# EAGLE design cerebellar V1.2 (EAGLE 9.6.2)
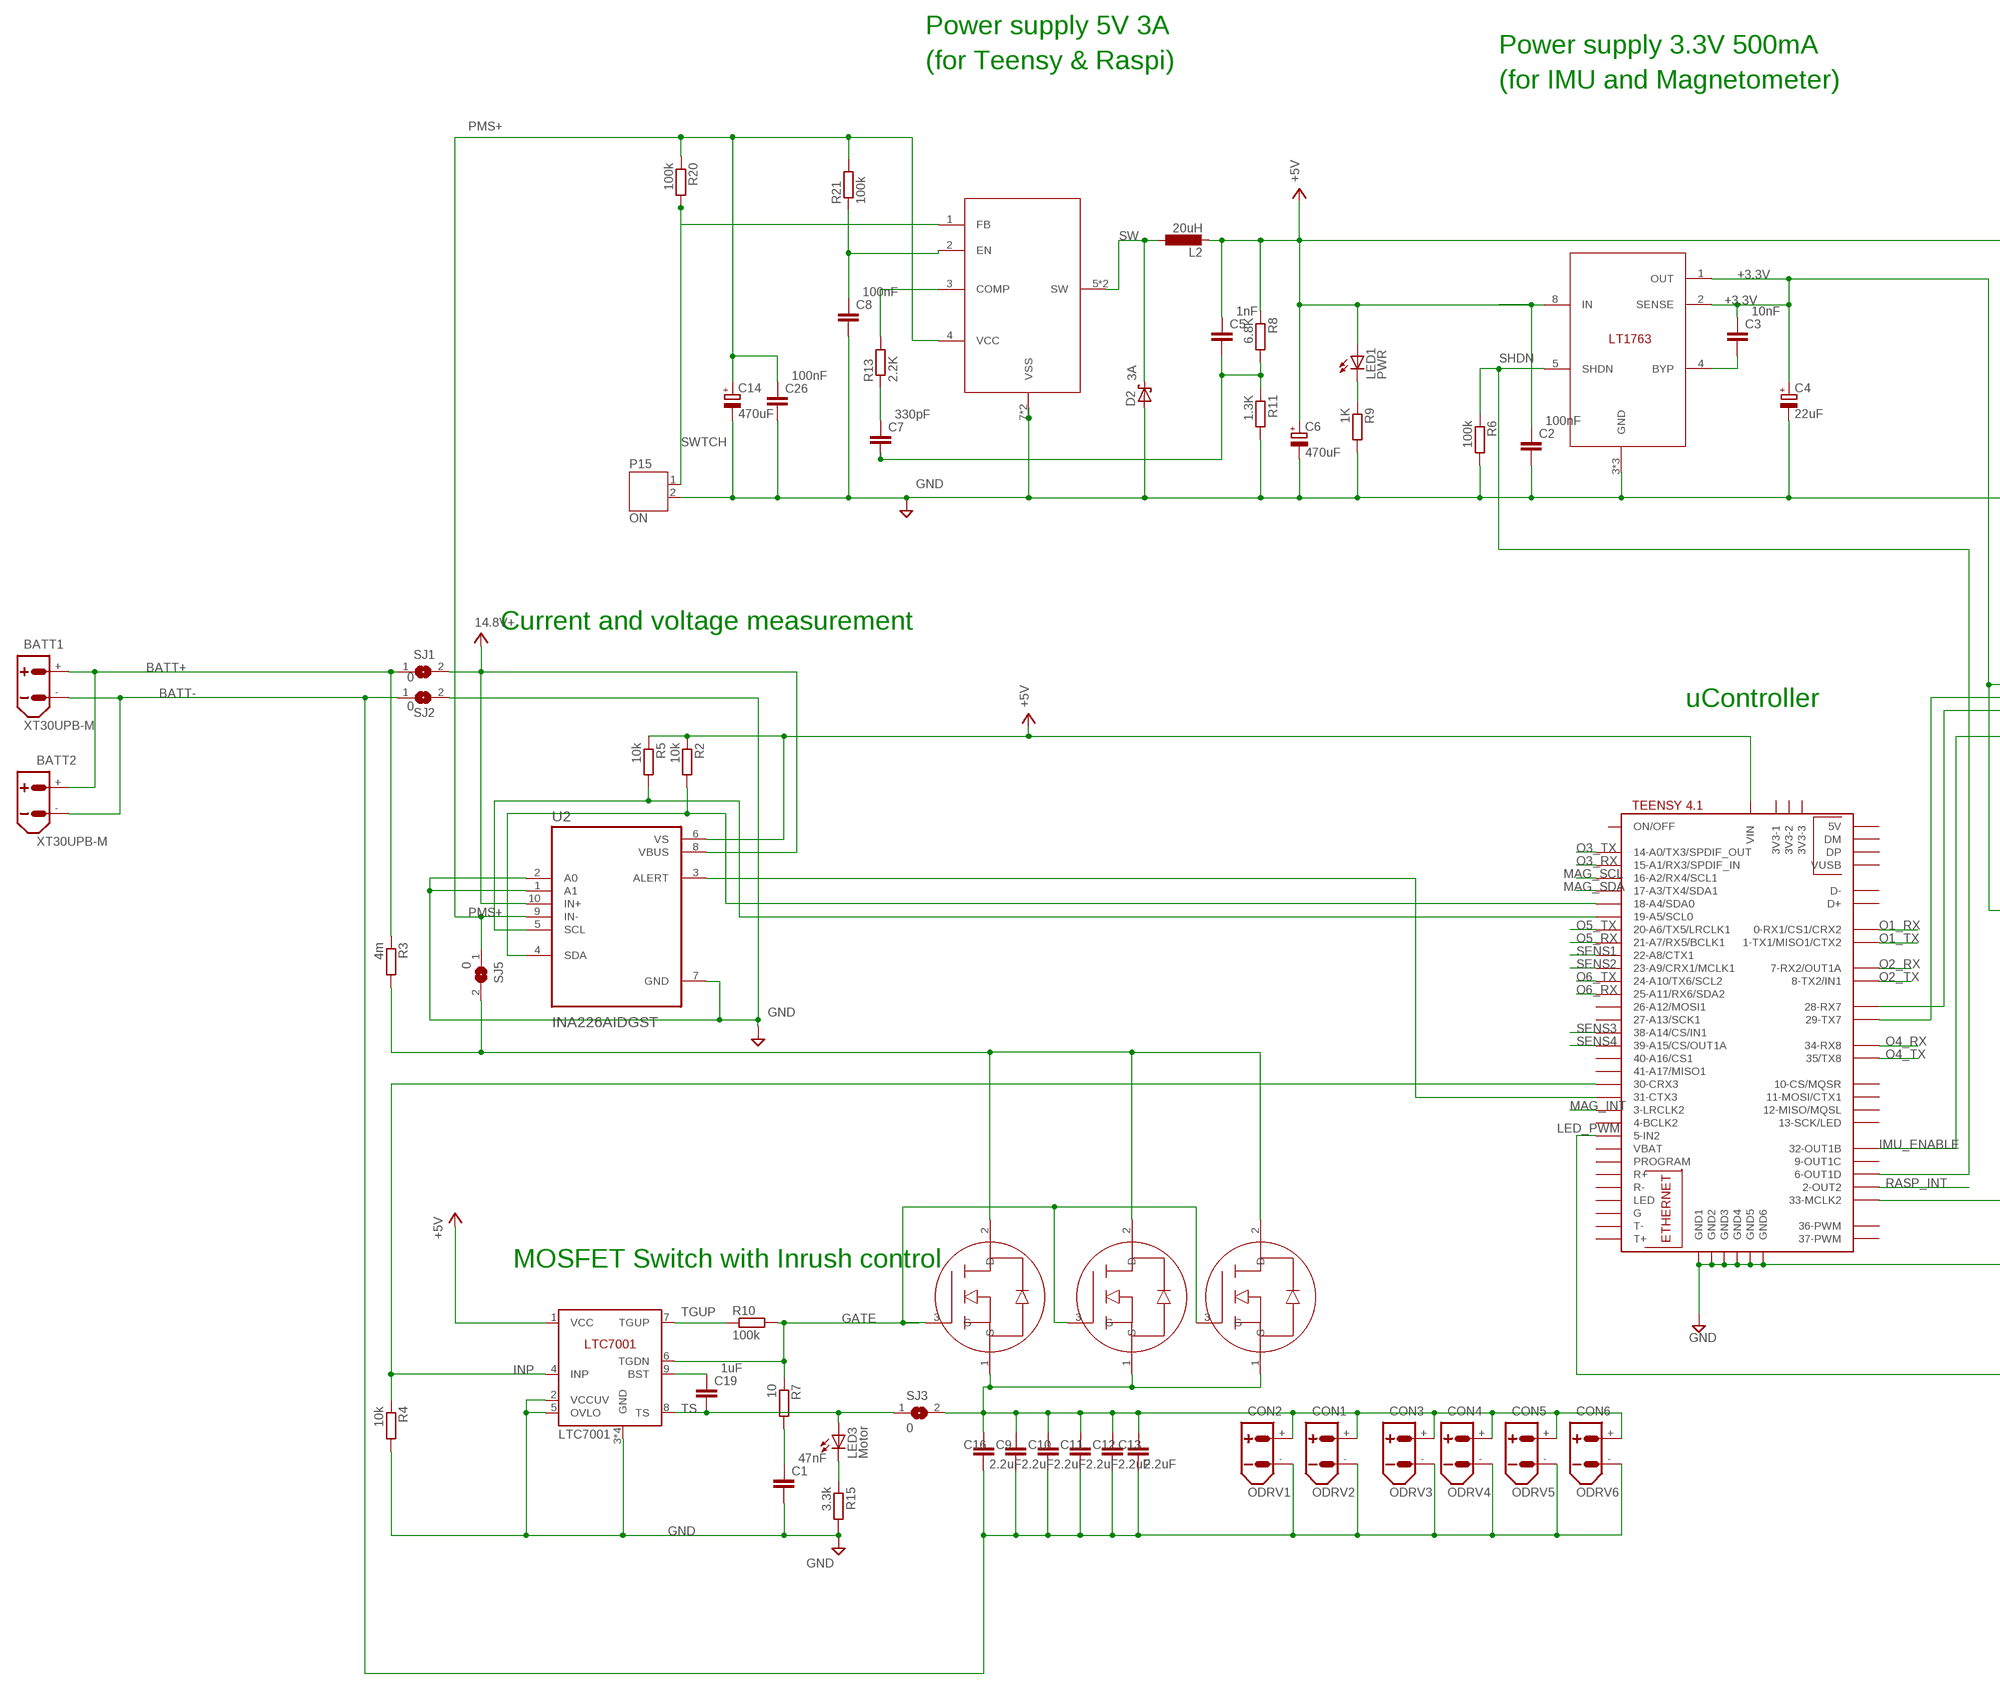
[diagram p0: schematic, sheet 1, part 1 of 2]
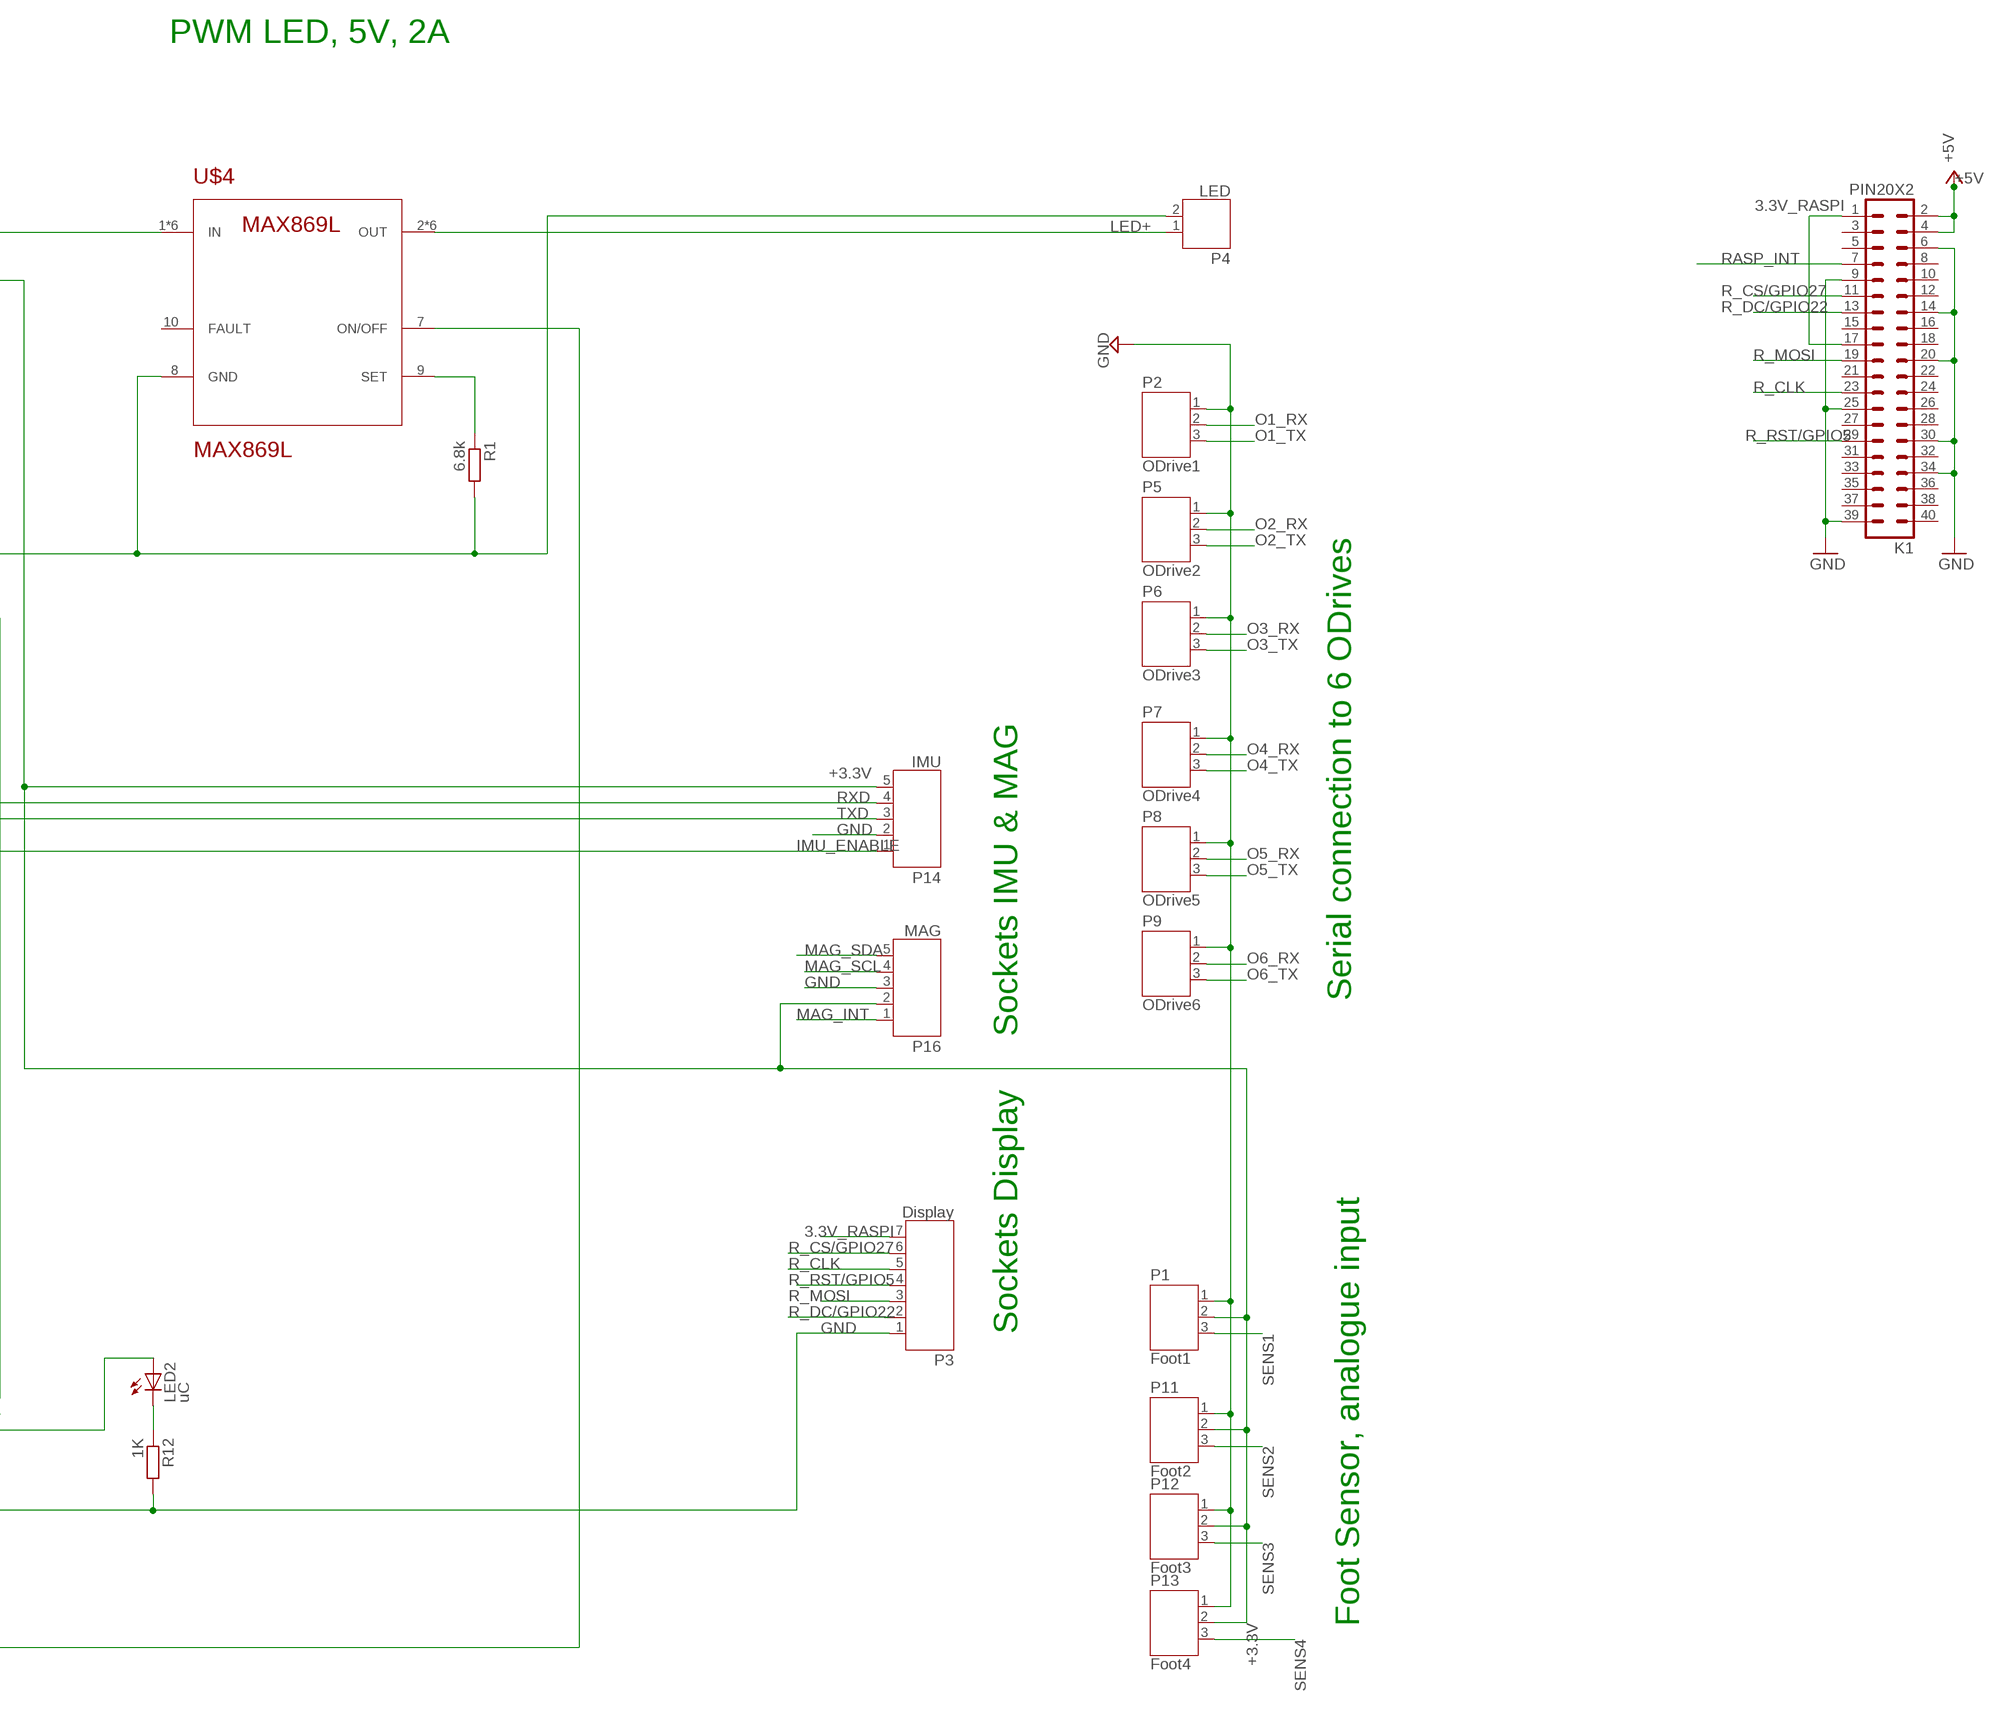
[diagram p1: schematic, sheet 1, part 2 of 2]

## Parts
BATT1  XT30UPB-M  [XT30UPB-M]
BATT2  XT30UPB-M  [XT30UPB-M]
C1  47nF  C-EU050-024X044  [C050-024X044]
C2  100nF  C-EU050-024X044  [C050-024X044]
C3  10nF  C-EU050-024X044  [C050-024X044]
C4  22uF  CPOL-EUE2-4  [E2-4]
C5  1nF  C-EU050-024X044  [C050-024X044]
C6  470uF  CPOL-EUE2.5-6  [E2,5-6]
C7  330pF  C-EU050-024X044  [C050-024X044]
C8  100nF  C-EU050-024X044  [C050-024X044]
C9  2.2uF  C-EU050-024X044  [C050-024X044]
C10  2.2uF  C-EU050-024X044  [C050-024X044]
C11  2.2uF  C-EU050-024X044  [C050-024X044]
C12  2.2uF  C-EU050-024X044  [C050-024X044]
C13  2.2uF  C-EU050-024X044  [C050-024X044]
C14  470uF  CPOL-EUE2.5-6  [E2,5-6]
C16  2.2uF  C-EU050-024X044  [C050-024X044]
C19  1uF  C-EU050-024X044  [C050-024X044]
C26  100nF  C-EU050-024X044  [C050-024X044]
CON1  ODRV2  XT30UPB-F  [XT30UPB-F]
CON2  ODRV1  XT30UPB-F  [XT30UPB-F]
CON3  ODRV3  XT30UPB-F  [XT30UPB-F]
CON4  ODRV4  XT30UPB-F  [XT30UPB-F]
CON5  ODRV5  XT30UPB-F  [XT30UPB-F]
CON6  ODRV6  XT30UPB-F  [XT30UPB-F]
D2  3A  SCHOTTKY-DIODEDO41  [DO41-10]
IC3  LTC7001  [MSOP10]
K1  PIN20X2  [PIN_20X2]
L2  20uH  L-EUIRF-3  [IRF-3]
LED1  PWR  LED3MM  [LED3MM]
LED2  uC  LED3MM  [LED3MM]
LED3  Motor  LED3MM  [LED3MM]
P1  Foot1  JST-PH3  [JST-PH3]
P2  ODrive1  JST-PH3  [JST-PH3]
P3  Display  JST-PH7  [JST-PH7]
P4  LED  JST-PH2  [JST-PH2]
P5  ODrive2  JST-PH3  [JST-PH3]
P6  ODrive3  JST-PH3  [JST-PH3]
P7  ODrive4  JST-PH3  [JST-PH3]
P8  ODrive5  JST-PH3  [JST-PH3]
P9  ODrive6  JST-PH3  [JST-PH3]
P11  Foot2  JST-PH3  [JST-PH3]
P12  Foot3  JST-PH3  [JST-PH3]
P13  Foot4  JST-PH3  [JST-PH3]
P14  IMU  JST-PH5  [JST-PH5]
P15  ON  JST-PH2  [JST-PH2]
P16  MAG  JST-PH5  [JST-PH5]
R1  6.8k  R-EU_0204/7  [0204/7]
R2  10k  R-EU_0204/7  [0204/7]
R3  4m  R-EU_R2512  [R2512]
R4  10k  R-EU_0204/7  [0204/7]
R5  10k  R-EU_0204/7  [0204/7]
R6  100k  R-EU_0204/7  [0204/7]
R7  10  R-EU_0204/7  [0204/7]
R8  6.8K  R-EU_0204/7  [0204/7]
R9  1K  R-EU_0204/7  [0204/7]
R10  100k  R-EU_0204/7  [0204/7]
R11  1.3K  R-EU_0204/7  [0204/7]
R12  1K  R-EU_0204/7  [0204/7]
R13  2.2K  R-EU_0204/7  [0204/7]
R15  3.3k  R-EU_0204/7  [0204/7]
R20  100k  R-EU_0204/7  [0204/7]
R21  100k  R-EU_0204/7  [0204/7]
SJ1  0  SJ  [SJ]
SJ2  0  SJ  [SJ]
SJ3  0  SJ  [SJ]
SJ5  0  SJ  [SJ]
U2  INA226AIDGST  [SOP50P490X110-10N]
U$1  TEENSY41  [TEENSY41]
U$2  IRF2804-BACK  [TO-220H-BACK]
U$3  IRF2804-BACK  [TO-220H-BACK]
U$4  MAX869L  MAX769L  [TSSOP-16]
U$5  IRF2804-BACK  [TO-220H-BACK]
U$6  TS2509  [SO08]
U$8  LT1763  [SO08]

## Nets
3.3V_RASPI: K1.1 K1.17 P3.7
+3.3V: C3.1 C4.+ P1.2 P11.2 P12.2 P13.2 P14.5 P16.2 U$8.1(OUT) U$8.2(SENSE)
+5V [5V]: C2.1 C5.1 C6.+ IC3.1(VCC) K1.2 K1.4 L2.2 LED1.A R2.1 R5.1 R8.1 U2.6(VS) U$1.VIN U$4.1(IN) U$4.4(IN) U$4.5(IN) U$4.12(IN) U$4.13(IN) U$4.16(IN) U$8.8(IN)
BATT+ [Battery]: BATT1.+ BATT2.+ R3.1 SJ1.1
BATT- [Battery]: BATT1.- BATT2.- C9.2 C10.2 C11.2 C12.2 C13.2 C16.2 CON1.- CON2.- CON3.- CON4.- CON5.- CON6.- SJ2.1
DRAIN [Battery]: R3.2 SJ5.2 U$2.2(D) U$3.2(D) U$5.2(D)
GATE: IC3.6(TGDN) R7.1 R10.2 U$2.3(G) U$3.3(G) U$5.3(G)
GND: C1.2 C2.2 C4.- C6.- C8.2 C14.- C26.2 D2.A IC3.2(VCCUV) IC3.3(GND) IC3.5(OVLO) IC3.10(GND) IC3.11(GND) IC3.12(GND) K1.6 K1.9 K1.14 K1.20 K1.25 K1.30 K1.34 K1.39 P1.1 P2.1 P3.1 P4.2 P5.1 P6.1 P7.1 P8.1 P9.1 P11.1 P12.1 P13.1 P14.2 P15.2 P16.3 R1.2 R4.2 R6.2 R9.2 R11.2 R12.2 R15.2 SJ2.2 U2.1(A1) U2.2(A0) U2.7(GND) U$1.GND1 U$1.GND2 U$1.GND3 U$1.GND4 U$1.GND5 U$1.GND6 U$4.8(GND) U$6.7(VSS) U$6.8(VSS) U$8.3(GND) U$8.6(GND) U$8.7(GND)
IMU_ENABLE: P14.1 U$1.32-OUT1B
INP: IC3.4(INP) R4.1 U$1.30-CRX3
LED+: P4.1 U$4.2(OUT) U$4.3(OUT) U$4.6(OUT) U$4.11(OUT) U$4.14(OUT) U$4.15(OUT)
LED_PWM: U$1.5-IN2 U$4.7(ON/OFF)
MAG_INT: P16.1 U$1.3-LRCLK2
MAG_SCL: P16.4 U$1.16-A2/RX4/SCL1
MAG_SDA: P16.5 U$1.17-A3/TX4/SDA1
N$1: C1.1 R7.2
N$2: R1.1 U$4.9(SET)
N$3: LED2.K(C) R12.1
N$4: LED2.A U$1.33-MCLK2
N$5: U2.3(ALERT) U$1.31-CTX3
N$7: C5.2 C7.2 R8.2 R11.1
N$8: C3.2 U$8.4(BYP)
N$9: R13.2 U$6.3(COMP)
N$10: C7.1 R13.1
N$17: R5.2 U2.5(SCL) U$1.19-A5/SCL0
N$22: R2.2 U2.4(SDA) U$1.18-A4/SDA0
N$24: C19.1 IC3.9(BST)
N$30: LED3.K(C) R15.1
N$39: LED1.K(C) R9.1
N$46: C8.1 R21.1 U$6.2(EN)
O1_RX: P2.2 U$1.0-RX1/CS1/CRX2
O1_TX: P2.3 U$1.1-TX1/MISO1/CTX2
O2_RX: P5.2 U$1.7-RX2/OUT1A
O2_TX: P5.3 U$1.8-TX2/IN1
O3_RX: P6.2 U$1.15-A1/RX3/SPDIF_IN
O3_TX: P6.3 U$1.14-A0/TX3/SPDIF_OUT
O4_RX: P7.2 U$1.34-RX8
O4_TX: P7.3 U$1.35-TX8(35/TX8)
O5_RX: P8.2 U$1.21-A7/RX5/BCLK1
O5_TX: P8.3 U$1.20-A6/TX5/LRCLK1
O6_RX: P9.2 U$1.25-A11/RX6/SDA2
O6_TX: P9.3 U$1.24-A10/TX6/SCL2
PMS+: C14.+ C26.1 R20.1 R21.2 SJ5.1 U2.9(IN-) U$6.4(VCC)
POWER+ [Battery]: C9.1 C10.1 C11.1 C12.1 C13.1 C16.1 CON1.+ CON2.+ CON3.+ CON4.+ CON5.+ CON6.+ SJ3.2 U$2.1(S) U$3.1(S) U$5.1(S)
R_CLK: K1.23 P3.5
R_CS/GPIO27: K1.11 P3.6
R_DC/GPIO22: K1.13 P3.2
R_MOSI: K1.19 P3.3
R_RST/GPIO5: K1.29 P3.4
RASP_INT: K1.7 U$1.2-OUT2
RXD: P14.4 U$1.29-TX7
SENS1: P1.3 U$1.22-A8/CTX1
SENS2: P11.3 U$1.23-A9/CRX1/MCLK1
SENS3: P12.3 U$1.38-A14/CS/IN1
SENS4: P13.3 U$1.39-A15/CS/OUT1A
SHDN: R6.1 U$1.6-OUT1D U$8.5(SHDN)
SW [5V]: D2.C L2.1 U$6.5(SW) U$6.6(SW)
SWTCH: P15.1 R20.2 U$6.1(FB)
TGUP: IC3.7(TGUP) R10.1
TS: C19.2 IC3.8(TS) LED3.A SJ3.1
TXD: P14.3 U$1.28-RX7
V+: SJ1.2 U2.8(VBUS) U2.10(IN+) ; supply symbol labelled 14.8V+
Unconnected: K1.3 K1.5 K1.8 K1.10 K1.12 K1.15 K1.16 K1.18 K1.21 K1.22 K1.24 K1.26 K1.27 K1.28 K1.31 K1.32 K1.33 K1.35 K1.36 K1.37 K1.38 K1.40 U$1.3V3-1 U$1.3V3-2 U$1.3V3-3 U$1.4-BCLK2 U$1.9-OUT1C U$1.10-CS\MQSR(10-CS/MQSR) U$1.11-MOSI/CTX1 U$1.12-MISO/MQSL U$1.13-SCK/LED U$1.26-A12/MOSI1 U$1.27-A13/SCK1 U$1.36-PWM U$1.37-PWM U$1.40-A16/CS1 U$1.41-A17/MISO1 U$1.+5V(5V) U$1.D+ U$1.D- U$1.DM U$1.DP U$1.G U$1.LED U$1.ON/OFF U$1.PROGRAM U$1.R+ U$1.R- U$1.T+ U$1.T- U$1.VBAT U$1.VUSB U$4.10(FAULT)

## Notes on the sheet
- Power supply 5V 3A
  (for Teensy & Raspi)
- Power supply 3.3V 500mA
  (for IMU and Magnetometer)
- PWM LED, 5V, 2A
- Serial connection to 6 ODrives
- Current and voltage measurement
- uController
- Sockets IMU & MAG
- Foot Sensor, analogue input
- Sockets Display
- MOSFET Switch with Inrush control

## Library data of the parts
BATT1 BATT2 CON1-CON6 = amass:XT30: AMASS XT30 connector Store in Japan AMASS XT30 connector <https://szc.jp/ams-xt30>
C1-C3 C5 C7-C13 C16 C19 C26 = rcl:C-EU: CAPACITOR, European symbol; SPICEPREFIX: C
C4 C6 C14 = rcl:CPOL-EU: POLARIZED CAPACITOR, European symbol; SPICEPREFIX: C
D2 = adafruit:SCHOTTKY-DIODE: Schottky Diode
IC3 = LTC7001:LTC7001: Fast 150V High Side NMOS Static Switch Driver Source: https://www.analog.com/en/products/ltc7001.html; MPN: AD7992BRMZ-0; OC_FARNELL: 1078311; OC_NEWARK: 31M4422
K1 = FLYFISH:PIN20X2
L2 = rcl:L-EU: INDUCTOR, European symbol; SPICEPREFIX: L
LED1-LED3 = adafruit:LED: LED OSRAM: - CHIPLED LG R971, LG N971, LY N971, LG Q971, LY Q971, LO R971, LY R971 LH N974, LH R974 LS Q976, LO Q976, LY Q976 LO Q996 - Hyper CHIPLED LW Q18S LB Q993, LB Q99A, LB R99A - SideLED LS A670, LO A670, LY A670, LG A670, LP A670 LB A673, LV A673, LT A673, LW A673 LH A674 LY A675 LS A676, LA A676, LO A676, LY A676, LW A676 LS A679, LY A679, LG A679 - Hyper Micro SIDELED® LS Y876, LA Y876, LO Y876, LY Y876 LT Y87S - SmartLED LW L88C, LW L88S LB L89C, LB L89S, LG L890 LS L89K, LO L89K, LY L89K LS L896, LA L896, LO L896, LY L896 - TOPLED LS T670, LO T670, LY T670, LG T670, LP T670 LSG T670, LSP T670, LSY T670, LOP T670, LYG T670 LG T671, LOG T671, LSG T671 LB T673, LV T673, LT T673, LW T673 LH T674 LS T676, LA T676, LO T676, LY T676, LB T676, LH T676, LSB T676, LW T676 LB T67C, LV T67C, LT T67C, LS T67K, LO T67K, LY T67K, LW E67C LS E67B, LA E67B, LO E67B, LY E67B, LB E67C, LV E67C, LT E67C LW T67C LS T679, LY T679, LG T679 LS T770, LO T770, LY T770, LG T770, LP T770 LB T773, LV T773, LT T773, LW T773 LH T774 LS E675, LA E675, LY E675, LS T675 LS T776, LA T776, LO T776, LY T776, LB T776 LHGB T686 LT T68C, LB T68C - Hyper Mini TOPLED® LB M676 - Mini TOPLED Santana® LG M470 LS M47K, LO M47K, LY M47K Source: http://www.osram.convergy.de/
P1 P2 P5-P9 P11-P13 = jst-ph:JST-PH3
P3 = jst-ph:JST-PH7
P4 P15 = jst-ph:JST-PH2
P14 P16 = jst-ph:JST-PH5
R1 R2 R4-R13 R15 R20 R21 = rcl:R-EU_: RESISTOR, European symbol; SPICEPREFIX: R
R3 = rcl:R-EU_: RESISTOR, European symbol; DIGIKEY: 541-WSK25124L000FEACT-ND; LINK: https://octopart.com/wsk25124l000fea-vishay-41934978?r=sp; MOUSER: 71-WSK25124L000FEA; SPICEPREFIX: R
SJ1-SJ3 SJ5 = jumper:SJ: SMD solder JUMPER
U2 = INA226AIDGST:INA226AIDGST: Check availability <https://pricing.snapeda.com/parts/INA226AIDGST/Texas%20Instruments/view-part?ref=eda>; AVAILABILITY: In Stock; DESCRIPTION: 36V, 16-bit, ultra-precise i2c output current/voltage/power monitor w/alert; MF: Texas Instruments; MP: INA226AIDGST; PACKAGE: VSSOP-10 Texas Instruments; PRICE: None; PURCHASE-URL: https://pricing.snapeda.com/search/part/INA226AIDGST/?ref=eda
U$1 = teensy:TEENSY41
U$2 U$3 U$5 = IRF2804:IRF2804-BACK: N-Channel Power MOSFET
U$4 = MAX869:MAX769L: MAX869L 2A, Current-Limited, High-Side P-Channel Switch with Thermal Shutdown
U$6 = TS2509:TS2509
U$8 = LT1763:LT1763

## Net classes
0 default: width 0.254 mm, clearance 0.152 mm
1 Battery: width 1.575 mm, clearance 0.152 mm
2 5V: width 0.406 mm, clearance 0.152 mm

## Board
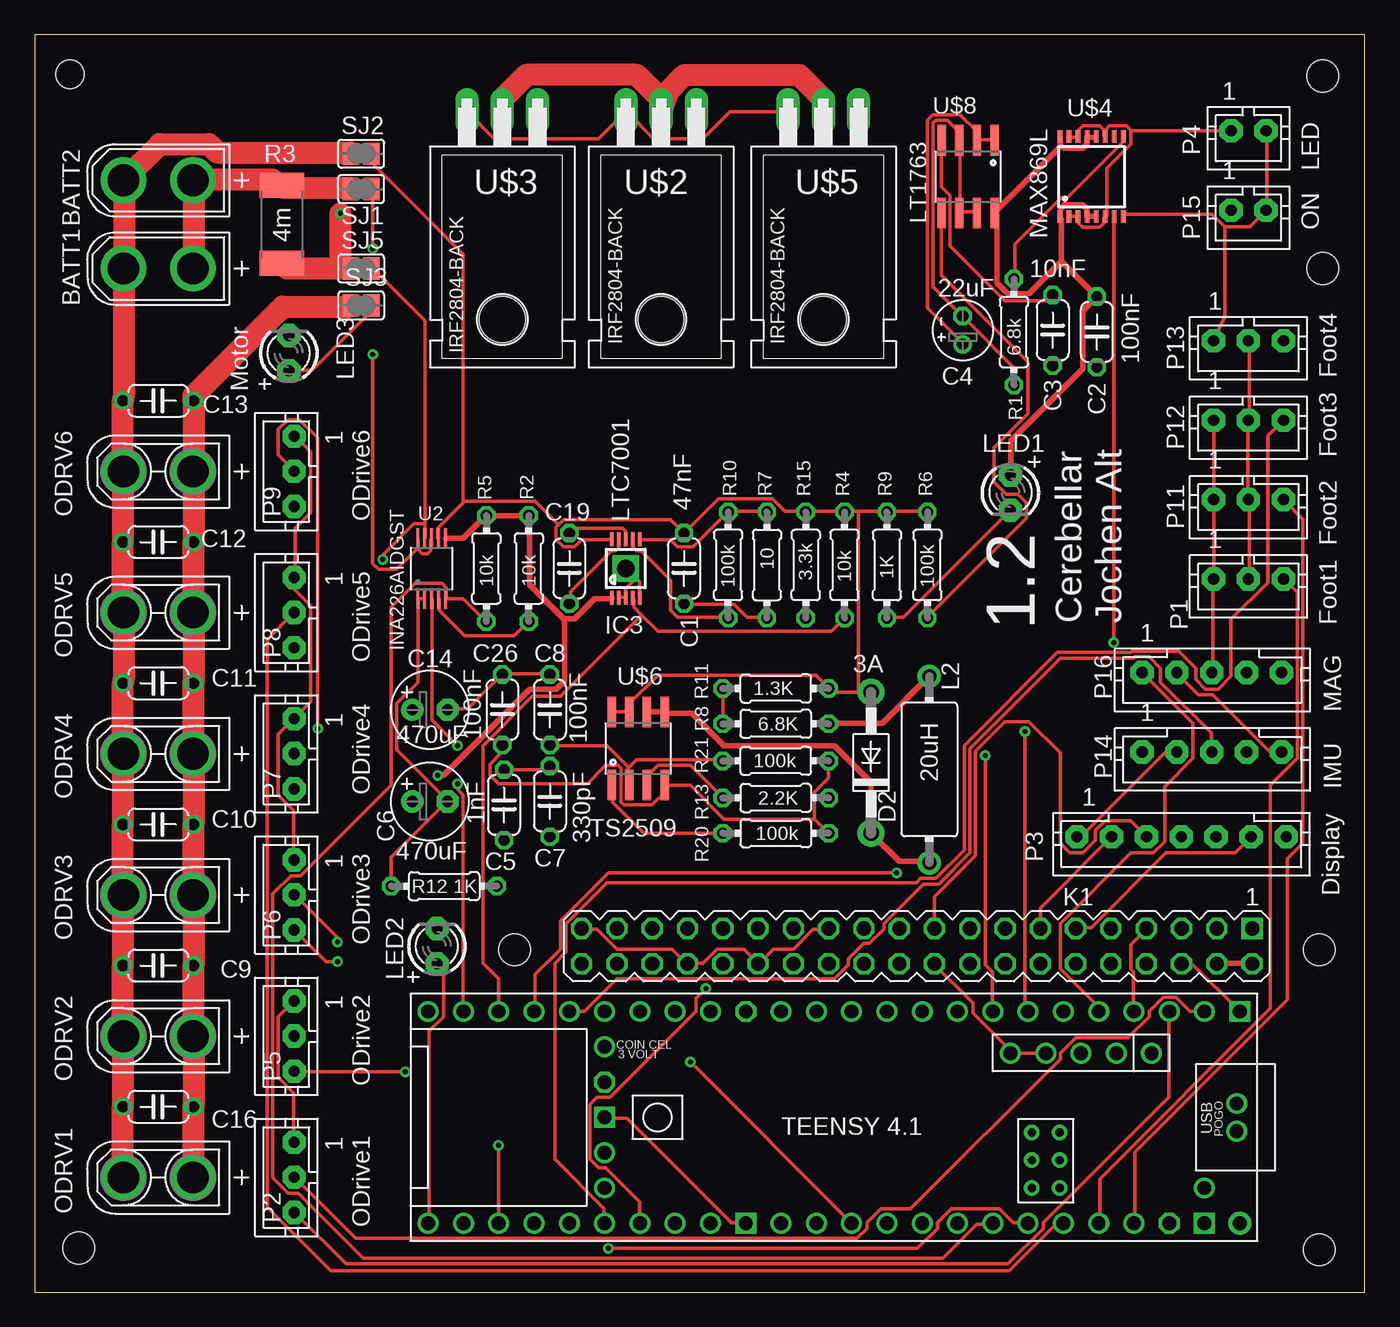
[diagram p2: board, top side]
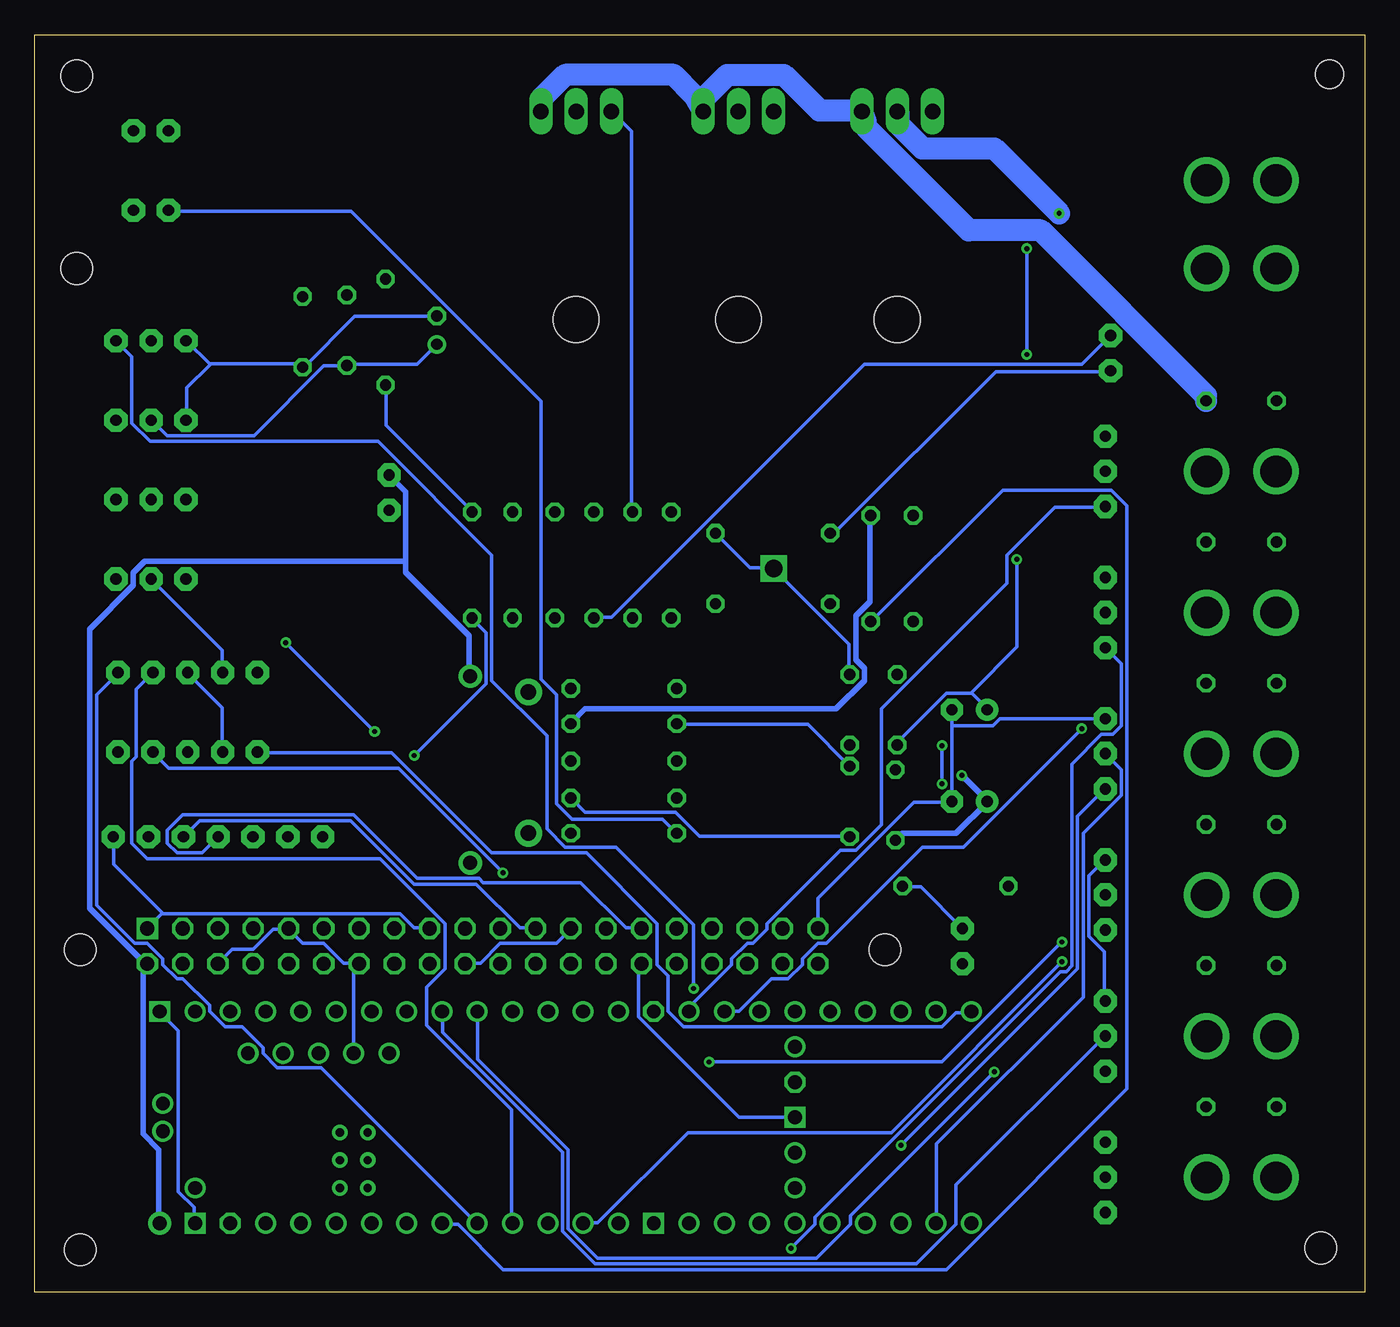
[diagram p3: board, bottom side, seen from below]

Size 95.74 x 90.47 mm. Coordinates in mm from the lower left corner, seen from the top.
Outline: 0,0 95.74,0 95.74,90.47 0,90.47 0,0
Copper layers (1*16): Top 0.035mm / dielectric 1.5mm / Bottom 0.035mm
Design rules "default": minimum track width 6mil, minimum drill 0.35mm, track to track 6mil, track to pad 6mil, pad to pad 6mil, via to via 6mil, smd to smd 6mil, copper to edge 40mil, drill to drill 6mil, minimum pad ring 10mil, minimum via ring 8mil, stop-mask expansion 4mil, vias tented up to drill 0mil, thermal gap 10mil
Holes 2.03 mm at 2.54,87.63
Holes 2.29 mm at 3.17,3.17 92.71,87.5 92.46,3.05 92.46,24.64 34.54,24.64 92.71,73.66
bRestrict: area 33.8,23.9 to 35.3,25.4; area 91.8,23.9 to 93.3,25.4; area 92,72.9 to 93.6,74.4; area 92,2.3 to 93.6,3.8; area 1.9,86.9 to 3.4,88.4; area 2.4,2.3 to 3.9,3.8; area 91.8,86.6 to 93.3,88.1

### Footprints (pad centres in the part's own frame; a part is rotated, then mirrored left to right if it is on the bottom)
XT30UPB-M = drill 2.286: + 2.5,0; - -2.5,0
C050-024X044 = drill 0.813 octagon: 1 -2.54,0; 2 2.54,0
E2-4 = drill 0.813 pad 1.27: + -1.016,0 | drill 0.813 pad 1.27 octagon: - 1.016,0
E2,5-6 = drill 0.813 pad 1.6: + -1.27,0 | drill 0.813 pad 1.6 octagon: - 1.27,0
XT30UPB-F = drill 2.286: + 2.5,0; - -2.5,0
DO41-10 = drill 1.118 pad 1.93: A 5.08,0; C -5.08,0
MSOP10 = smd 0.25 x 1: 1 -1,-2.113; 2 -0.5,-2.113; 3 0,-2.113; 4 0.5,-2.113; 5 1,-2.113; 6 1,2.113; 7 0.5,2.113; 8 0,2.113; 9 -0.5,2.113; 10 -1,2.113 | drill 1.27 square: 11 0,0 | smd 1.524 x 1.524: 12 0,0
PIN_20X2 = drill 1.016 square: 1 -24.13,-1.27 | drill 1.016 octagon: 2 -24.13,1.27; 3 -21.59,-1.27; 4 -21.59,1.27; 5 -19.05,-1.27; 6 -19.05,1.27; 7 -16.51,-1.27; 8 -16.51,1.27; 9 -13.97,-1.27; 10 -13.97,1.27; 11 -11.43,-1.27; 12 -11.43,1.27; 13 -8.89,-1.27; 14 -8.89,1.27; 15 -6.35,-1.27; 16 -6.35,1.27; 17 -3.81,-1.27; 18 -3.81,1.27; 19 -1.27,-1.27; 20 -1.27,1.27; 21 1.27,-1.27; 22 1.27,1.27; 23 3.81,-1.27; 24 3.81,1.27; 25 6.35,-1.27; 26 6.35,1.27; 27 8.89,-1.27; 28 8.89,1.27; 29 11.43,-1.27; 30 11.43,1.27; 31 13.97,-1.27; 32 13.97,1.27; 33 16.51,-1.27; 34 16.51,1.27; 35 19.05,-1.27; 36 19.05,1.27; 37 21.59,-1.27; 38 21.59,1.27; 39 24.13,-1.27; 40 24.13,1.27
IRF-3 = drill 1 pad 1.676: 1 -6.705,0; 2 6.73,0
LED3MM = drill 0.813 pad 1.676 octagon: A -1.27,0; K 1.27,0
JST-PH3 = drill 0.813 pad 1.676 octagon: 1 2.524,-1.524; 2 0.016,-1.524; 3 -2.524,-1.524
JST-PH7 = drill 0.813 pad 1.676 octagon: 1 7.54,0; 2 5.032,0; 3 2.524,0; 4 0.016,0; 5 -2.492,0; 6 -5,0; 7 -7.54,0
JST-PH2 = drill 0.813 pad 1.676 octagon: 1 1.254,0; 2 -1.254,0
JST-PH5 = drill 0.813 pad 1.676 octagon: 1 5.762,0; 2 3.254,0; 3 0.746,0; 4 -1.762,0; 5 -4.27,0
0204/7 = drill 0.813 octagon: 1 -3.81,0; 2 3.81,0
R2512 = smd 1.8 x 3.2: 1 -2.8,0; 2 2.8,0
SJ = smd 1.168 x 1.6: 1 -0.762,0; 2 0.762,0
SOP50P490X110-10N = smd 1.47 x 0.28: 1 -2.15,1; 2 -2.15,0.5; 3 -2.15,0; 4 -2.15,-0.5; 5 -2.15,-1; 6 2.15,-1; 7 2.15,-0.5; 8 2.15,0; 9 2.15,0.5; 10 2.15,1
TEENSY41 = drill 1: 0-RX1/CS1/CRX2 -27.94,-7.62; 1-TX1/MISO1/CTX2 -25.4,-7.62; 2-OUT2 -22.86,-7.62; 3-LRCLK2 -20.32,-7.62; 4-BCLK2 -17.78,-7.62; 5-IN2 -15.24,-7.62; 6-OUT1D -12.7,-7.62; 7-RX2/OUT1A -10.16,-7.62; 8-TX2/IN1 -7.62,-7.62; 9-OUT1C -5.08,-7.62; 10-CS\MQSR -2.54,-7.62; 11-MOSI/CTX1 0,-7.62; 12-MISO/MQSL 2.54,-7.62; 13-SCK/LED 2.54,7.62; 14-A0/TX3/SPDIF_OUT 0,7.62; 15-A1/RX3/SPDIF_IN -2.54,7.62; 16-A2/RX4/SCL1 -5.08,7.62; 17-A3/TX4/SDA1 -7.62,7.62; 18-A4/SDA0 -10.16,7.62; 19-A5/SCL0 -12.7,7.62; 20-A6/TX5/LRCLK1 -15.24,7.62; 21-A7/RX5/BCLK1 -17.78,7.62; 22-A8/CTX1 -20.32,7.62; 23-A9/CRX1/MCLK1 -22.86,7.62; 24-A10/TX6/SCL2 7.62,-7.62; 25-A11/RX6/SDA2 10.16,-7.62; 26-A12/MOSI1 12.7,-7.62; 27-A13/SCK1 15.24,-7.62; 28-RX7 17.78,-7.62; 29-TX7 20.32,-7.62; 30-CRX3 22.86,-7.62; 31-CTX3 25.4,-7.62; 32-OUT1B 27.94,-7.62; 33-MCLK2 27.94,7.62; 34-RX8 25.4,7.62; 35-TX8 22.86,7.62; 36-PWM 20.32,7.62; 37-PWM 17.78,7.62; 38-A14/CS/IN1 15.24,7.62; 39-A15/CS/OUT1A 12.7,7.62; 40-A16/CS1 10.16,7.62; 41-A17/MISO1 7.62,7.62; +5V -24.13,-4.62; D+ -30.25,-1; D- -30.25,1; DM -21.59,-4.62; DP -19.05,-4.62; GND4 -16.51,-4.62; GND5 -13.97,-4.62; ON/OFF 15.24,5.08; PROGRAM 15.24,2.54; VBAT 15.24,-5.08; VUSB -27.94,5.08 | drill 1 octagon: 3V3-1 5.08,-7.62; 3V3-2 15.24,-2.54; 3V3-3 -25.4,7.62 | drill 0.6: G -15.51,3.08; LED -17.51,3.08; R+ -17.51,5.08; R- -15.51,5.08; T+ -15.51,1.08; T- -17.51,1.08 | drill 1 square: GND1 -30.48,-7.62; GND2 15.24,0; GND3 5.08,7.62; GND6 -27.94,7.62 | drill 1 pad 1.676: VIN -30.48,7.62
TO-220H-BACK = drill 1.118 long: 1 -2.54,-7.62; 2 0,-7.62; 3 2.54,-7.62 | hole 3.302: 0,7.366
TSSOP-16 = smd 0.9 x 0.35: 1 -2.875,2.275; 2 -2.875,1.625; 3 -2.875,0.975; 4 -2.875,0.325; 5 -2.875,-0.325; 6 -2.875,-0.975; 7 -2.875,-1.625; 8 -2.875,-2.275; 9 2.875,-2.275; 10 2.875,-1.625; 11 2.875,-0.975; 12 2.875,-0.325; 13 2.875,0.325; 14 2.875,0.975; 15 2.875,1.625; 16 2.875,2.275
SO08 = smd 0.61 x 2.21: 1 -1.905,-2.616; 2 -0.635,-2.616; 3 0.635,-2.616; 4 1.905,-2.616; 5 1.905,2.616; 6 0.635,2.616; 7 -0.635,2.616; 8 -1.905,2.616

### Placement (x,y rotation side)
BATT1  8.89,73.66 0 top
BATT2  8.89,80.01 0 top
C1  46.74,52.07 90 top
C2  76.45,69.09 270 top
C3  73.28,69.22 90 top
C4  66.8,69.22 90 top
C5  33.78,35.05 90 top
C6  28.45,35.31 0 top
C7  37.08,35.31 90 top
C8  37.08,41.91 90 top
C9  8.89,23.5 180 top
C10  8.89,33.66 180 top
C11  8.89,43.81 180 top
C12  8.89,53.98 180 top
C13  8.89,64.14 180 top
C14  28.45,41.91 0 top
C16  8.89,13.34 180 top
C19  38.48,52.07 90 top
C26  33.66,41.91 90 top
CON1  8.89,18.41 0 top
CON2  8.89,8.26 0 top
CON3  8.89,28.57 0 top
CON4  8.89,38.73 0 top
CON5  8.89,48.9 0 top
CON6  8.89,59.05 0 top
D2  60.2,38.1 90 top
IC3  42.55,52.07 0 top
K1  63.5,24.89 180 top
L2  64.39,37.59 90 top
LED1  70.23,57.53 270 top
LED2  28.96,24.89 90 top
LED3  18.29,67.56 90 top
P1  87.38,49.78 180 top
P2  17.14,8.26 90 top
P3  82.55,32.77 180 top
P4  87.38,83.57 180 top
P5  17.14,18.41 90 top
P6  17.14,28.57 90 top
P7  17.14,38.73 90 top
P8  17.14,48.9 90 top
P9  17.14,59.05 90 top
P11  87.38,55.5 180 top
P12  87.38,61.21 180 top
P13  87.38,66.93 180 top
P14  85.47,38.86 180 top
P15  87.38,77.85 180 top
P16  85.47,44.58 180 top
R1  70.48,69.09 270 top
R2  35.56,52.07 270 top
R3  17.78,76.83 270 top
R4  58.29,52.32 90 top
R5  32.51,52.07 270 top
R6  64.26,52.32 90 top
R7  52.7,52.32 270 top
R8  53.34,40.89 180 top
R9  61.34,52.32 90 top
R10  49.91,52.32 90 top
R11  53.34,43.43 0 top
R12  29.46,29.21 180 top
R13  53.34,35.56 180 top
R15  55.5,52.32 90 top
R20  53.34,33.02 180 top
R21  53.34,38.23 0 top
SJ1  23.49,79.38 0 top
SJ2  23.49,81.92 0 top
SJ3  23.49,70.99 180 top
SJ5  23.49,73.66 180 top
U2  28.58,52.07 90 top
U$1  56.26,12.57 180 top
U$2  45.09,77.34 180 top
U$3  33.66,77.34 180 top
U$4  76.07,80.26 90 top
U$5  56.77,77.34 180 top
U$6  43.43,39.12 0 top
U$8  67.18,80.26 180 top

### Tracks (layer width: path | path; a pad name or v marks a point on that pad's centre or on a via)
3.3V_RASPI
  Bottom 0.254: 86.61,27.23 69.44,27.23 68.43,26.21 67.31,26.21 K1.17 | 86.61,27.23 87.63,26.21 K1.1 | P3.7 90.07,32.72 90.07,30.79 86.61,27.33 86.61,27.23
+3.3V
  Top 0.254: U$8.1 69.04,82.91 67.82,82.91 U$8.2 67.82,83.52 66.6,84.73 64.67,84.73 64.26,84.33 64.26,70.81 66.8,68.28 C4.+ | P1.2 87.43,51.36 87.43,56.95 P11.2 87.32,57.15 87.32,62.74 P12.2 87.43,62.84 87.43,68.43 P13.2 | P14.5 89.66,38.91 88.85,38.91 84.78,42.98 83.77,42.98 82.24,44.5 P16.2
  Bottom 0.254: C4.+ 66.8,68.17 68.22,66.75 73.2,66.75 C3.1 73.3,66.65 74.93,66.65 79.96,61.62 86.21,61.62 87.32,62.74 P12.2 | P16.2 82.24,44.6 82.24,46.18 87.32,51.26 P1.2
+5V  (via drill 0.35)
  Top 0.406: U2.6 29.62,54.25 30.84,54.25 32.46,55.88 R5.1 R2.1 35.61,55.88 35.61,50.9 38.05,48.46 38.15,48.46 | 38.15,48.46 38.86,48.46 40.28,49.89 41.5,49.89 IC3.1 | v29.01,37.19 29.41,37.19 35.61,43.38 37.54,43.38 38.15,43.99 38.15,48.46 | K1.4 85.09,23.67 87.63,23.67 K1.2 | R8.1 57.15,40.95 61.01,40.95 64.36,44.3 L2.2 | 73.91,82.5 74.12,82.3 75.44,82.3 75.74,82.6 75.74,83.11 U$4.13 75.95,83.11 76.35,83.11 U$4.12 | 73.91,82.5 73.81,82.6 73.81,83.11 U$4.16 | 73.91,82.5 69.14,77.72 U$8.8 69.24,77.52 69.24,72.64 70.05,71.83 71.58,71.83 73.91,74.17 | U$4.5 76.35,77.42 75.95,77.42 U$4.4 75.74,77.42 75.74,77.93 75.44,78.23 74.12,78.23 73.81,77.93 73.81,77.42 U$4.1 73.91,77.22 73.91,74.17 | 73.91,74.17 C2.1 75.44,70.61 75.44,66.45 70.26,61.27 70.26,58.83 LED1.A
  Bottom 0.406: C5.1 33.27,33.02 29.41,33.02 27.18,35.26 C6.+ 27.28,35.46 v29.01,37.19 | U$1.VIN 86.82,4.98 86.82,10.26 87.93,11.38 87.93,23.27 87.63,23.57 K1.2 87.73,23.77 87.93,23.77 91.8,27.64 91.8,47.7 88.65,50.85 88.65,51.77 87.83,52.58 69.04,52.58 | 69.04,52.58 69.04,57.61 LED1.A | 69.04,52.58 69.04,51.82 64.47,47.24 64.47,44.4 L2.2 | R2.1 35.61,55.88 35.61,49.68 36.63,48.67 36.63,45.52 36.02,44.91 36.02,43.99 38.05,41.96 56.13,41.96 57.15,40.95 R8.1
BATT+
  Top 1.575: SJ1.1 22.71,79.45 17.93,79.45 17.83,79.55 R3.1 17.12,80.06 11.43,80.06 BATT2.+ 11.43,79.25 11.43,73.66 BATT1.+
BATT-
  Top 1.575: SJ2.1 22.71,81.99 13.16,81.99 12.55,82.6 8.99,82.6 6.45,80.06 BATT2.- 6.45,79.25 6.45,73.66 BATT1.- 6.45,72.95 6.45,64.82 6.35,64.11 | 6.35,64.11 6.35,59.13 CON6.- 6.35,58.32 C12.2 6.35,53.95 6.35,48.97 CON5.- 6.45,48.16 6.45,44.5 6.35,43.79 | 6.35,64.11 C13.2 | CON2.- 6.35,8.33 6.35,13.31 C16.2 6.35,17.68 CON1.- 6.35,18.49 6.35,23.47 C9.2 6.35,27.84 CON3.- 6.35,28.65 6.35,33.63 C10.2 6.35,38 CON4.- 6.35,38.81 6.35,43.79 | 6.35,43.79 C11.2
DRAIN  (via drill 0.35)
  Top 1.575: 22,73.66 18.14,73.66 17.83,73.97 R3.2 | 22,73.66 SJ5.2 | U$3.2 33.68,85.04 33.68,85.85 35.41,87.58 43.33,87.58 45.06,85.85 45.06,85.04 U$2.2 45.57,86.36 46.79,87.58 55.02,87.58 56.74,85.85 56.74,85.04 U$5.2 | v22,77.62 22,73.66
  Bottom 1.575: v22,77.62 26.67,82.3 31.85,82.3 33.58,84.02 33.58,84.94 U$3.2
GATE
  Top 0.254: IC3.6 43.64,54.15 45.77,54.15 46.28,53.65 47.4,53.65 49.84,56.08 R10.2 49.94,56.19 52.68,56.19 R7.1 | U$3.3 33.07,83.01 40.59,83.01 U$2.3 42.62,84.94 44.55,83.01 48.11,83.01 50.04,84.94 54.2,84.94 U$5.3
  Bottom 0.254: U$5.3 52.78,83.52 52.78,56.19 R7.1
GND
  Top 0.254: U$8.7 67.82,77.72 66.6,77.72 U$8.6 66.6,77.83 66.6,82.8 U$8.3 66.5,82.91 66.5,83.52 65.68,84.33 64.87,84.33 64.67,84.12 64.67,72.34 66.7,70.31 C4.- 66.8,70.21 70.46,66.55 70.46,65.33 R1.2 | U$4.8 78.53,77.57 84.73,77.57 85.65,76.66 | 85.65,76.66 87.48,76.66 88.59,77.78 P15.2 88.7,77.88 88.7,83.57 P4.2 | P3.1 75.03,32.82 75.34,32.82 81.33,38.81 82.14,38.81 P14.2 | P16.3 84.78,44.6 84.78,51.26 P1.1 84.89,51.36 84.89,56.95 P11.1 84.89,57.05 84.89,62.74 P12.1 | 85.65,76.66 85.65,70.2 P13.1 | U$1.GND4 72.69,17.17 70.26,17.17 U$1.GND5 70.16,17.27 70.16,17.48 67.51,20.12 67.51,20.83 64.77,23.57 K1.20 | U$1.GND1 83.36,23.57 82.55,23.57 K1.6 | U$1.GND3 51.16,4.98 50.14,4.98 42.62,12.5 41.1,12.5 U$1.GND2 | K1.39 39.37,26.11 40.49,26.11 41.91,24.69 45.87,24.69 46.89,23.67 K1.34 46.99,23.67 48.11,23.67 49.12,24.69 51.05,24.69 52.07,23.67 K1.30 52.17,23.67 53.19,24.69 54.61,24.69 56.03,26.11 57.15,26.11 K1.25 | P9.1 18.74,61.57 19.86,60.45 19.86,56.08 18.74,54.97 18.74,51.51 P8.1 18.64,51.31 18.64,50.6 19.86,49.38 19.86,42.47 18.74,41.35 P7.1 18.64,41.25 17.53,40.13 17.53,35.76 18.64,34.65 18.64,31.19 P6.1 | P2.1 18.64,10.87 18.64,14.33 17.53,15.44 17.53,19.81 18.64,20.93 P5.1 | C8.2 37.03,44.5 33.68,44.5 C26.2 33.58,44.4 31.14,41.96 29.72,41.96 C14.- | U2.2 27.99,49.89 27.58,49.89 U2.1 27.58,49.78 27.58,43.89 26.06,42.37 26.06,39.01 29.72,35.36 C6.- 29.62,35.26 25.65,31.29 R12.2 | U$6.8 41.61,41.76 42.72,41.76 U$6.7 42.72,41.86 42.72,42.27 44.86,44.4 56.24,44.4 57.15,43.48 R11.2 57.25,43.38 57.45,43.18 D2.A 59.28,43.28 59.28,56.19
  Top 0.254: R6.2 64.26,56.19 61.42,56.19 R9.2 61.32,56.19 59.28,56.19 | 59.28,56.19 58.37,56.19 R4.2 58.27,56.19 55.52,56.19 R15.2 55.42,56.19 54,56.19 53.09,57.1 49.23,57.1 C1.2 45.77,55.58 38.05,55.58 37.69,55.22 | IC3.2 42.11,49.99 42.52,49.99 IC3.3 42.52,50.09 42.52,50.6 43.28,51.36 | 43.28,51.36 42.62,52.02 IC3.12 42.52,52.12 | 43.28,51.36 43.54,51.1 43.54,49.99 IC3.5 | 37.69,55.22 37.54,55.07 37.54,54.15 38.05,53.65 38.86,53.65 39.37,54.15 41.5,54.15 IC3.10 | 30.89,56.84 30.94,56.9 36.02,56.9 37.69,55.22 | 30.89,56.84 29.01,54.97 29.01,54.25 U2.7 | SJ2.2 24.33,81.89 24.33,81.18 30.84,74.68 30.84,56.9 30.89,56.84
  Bottom 0.254: 83.16,66.8 76.71,66.8 C2.2 76.35,66.55 72.69,70.21 66.8,70.21 C4.- | 83.16,66.8 84.78,68.43 P13.1 | P12.1 84.78,62.74 84.78,65.08 83.16,66.7 83.16,66.8 | P14.2 82.24,38.91 82.24,42.06 84.68,44.5 P16.3 | U$1.GND4 72.8,17.27 72.8,23.57 K1.14 72.39,23.67 73.51,23.67 74.93,25.09 76.45,25.09 77.47,26.11 K1.9 77.57,26.11 78.59,26.11 80.01,24.69 81.53,24.69 82.55,23.67 K1.6 | U$1.GND6 84.28,4.98 84.28,6.1 85.39,7.21 85.39,18.8 86.72,20.12 U$1.GND1 | K1.20 64.77,23.67 63.65,23.67 62.23,25.09 58.17,25.09 57.15,26.11 K1.25 | U$1.GND2 41.1,12.6 45.06,12.6 52.27,19.81 52.27,23.37 52.07,23.57 K1.30 | P5.1 18.74,21.03 18.74,24.49 19.86,25.6 19.86,29.97 18.74,31.09 P6.1 | 29.72,40.74 C6.- 29.82,35.26 32.46,35.26 39.37,28.35 K1.39 | 29.72,40.74 C14.- | C1.2 44.25,52.12 42.62,52.12 IC3.12 42.52,52.02 37.13,46.63 37.13,44.5 C8.2 | 29.72,40.74 26.77,40.74 26.26,41.25 18.74,41.25 P7.1 | R1.2 70.46,65.23 70.46,62.38 64.26,56.19 R6.2
IMU_ENABLE
  Bottom 0.254: U$1.32-OUT1B 28.4,20.12 29.41,20.12 30.43,19.1 49.02,19.1 50.14,20.22 50.14,22.76 50.95,23.57 50.95,26.52 56.03,31.6 62.84,31.6 70.05,38.81 79.7,38.81 P14.1
INP
  Top 0.254: 43.69,48.72 44.86,47.55 57.35,47.55 58.27,48.46 R4.1 | 43.69,48.72 43.13,49.28 43.13,49.89 IC3.4 | 43.69,48.72 37.85,42.88 35.81,42.88 32.26,39.32 32.26,23.67 33.38,22.55 33.38,20.22 U$1.30-CRX3
LED+
  Top 0.254: U$4.2 74.52,77.42 75.03,77.42 U$4.3 75.13,77.32 75.13,76.91 75.44,76.61 76.66,76.61 76.96,76.91 76.96,77.32 U$4.6 77.16,77.42 77.16,80.87 78.89,82.6 78.89,83.57 | U$4.15 74.52,83.11 75.03,83.11 U$4.14 75.13,83.21 75.13,83.62 75.44,83.92 76.66,83.92 76.96,83.62 | 76.96,83.62 76.96,83.21 U$4.11 | 78.89,83.57 78.89,83.62 78.59,83.92 77.37,83.92 77.06,83.62 76.96,83.62 | 78.89,83.57 P4.1
LED_PWM  (via drill 0.35)
  Top 0.254: v77.67,46.74 77.67,77.32 U$4.7 | v71.27,40.34 71.27,20.42 U$1.5-IN2
  Bottom 0.254: v71.27,40.34 v77.67,46.74
MAG_INT
  Top 0.254: U$1.3-LRCLK2 76.56,20.22 76.56,20.52 73.81,23.27 73.81,26.52 78.89,31.6 80.52,31.6 81.33,32.41 81.33,36.37 83.36,38.41 83.36,40.95 79.81,44.5 P16.1
MAG_SCL
  Bottom 0.254: U$1.16-A2/RX4/SCL1 61.42,4.98 61.42,13.11 67.51,19.2 67.51,21.95 66.19,23.27 66.19,26.52 70.87,31.19 87.63,31.19 88.75,32.31 88.75,38.2 88.44,38.51 88.44,43.38 87.32,44.5 P16.4
MAG_SDA
  Bottom 0.254: U$1.17-A3/TX4/SDA1 63.96,4.98 75.13,16.15 78.28,16.15 79.3,17.17 79.3,17.58 80.82,19.1 82.04,19.1 83.16,20.22 83.16,20.62 85.09,22.55 85.5,22.55 86.51,23.57 86.51,23.98 87.63,25.09 88.54,25.09 91.29,27.84 91.29,42.98 89.76,44.5 P16.5
N$1
  Top 0.254: R7.2 52.68,48.56 51.26,48.56 50.34,49.48 46.79,49.48 C1.1
N$2
  Top 0.254: U$4.9 78.28,83.11 78.28,82.7 74.32,78.74 73.91,78.74 70.56,75.39 70.56,72.95 R1.1
N$3
  Bottom 0.254: LED2.K 31.95,29.16 33.27,29.16 R12.1
N$4
  Top 0.254: LED2.A 29.41,23.16 29.41,19.81 28.4,18.8 28.4,4.98 U$1.33-MCLK2
N$5  (via drill 0.35)
  Top 0.254: v30.43,39.32 28.6,41.15 28.6,49.89 U2.3 | v30.43,36.58 30.43,36.17 30.84,35.76 30.84,20.22 U$1.31-CTX3
  Bottom 0.254: v30.43,36.58 v30.43,39.32
N$7
  Top 0.254: R11.1 R8.2 | C5.2 36.83,37.59 C7.2
  Bottom 0.254: C7.2 40.08,40.84 49.53,40.84 R8.2
N$8
  Top 0.254: U$8.4 65.28,79.55 65.89,78.94 65.89,75.29 69.85,71.32 72.8,71.32 73.2,71.73 C3.2
N$9
  Top 0.254: R13.2 47.19,37.9 44.86,37.9 44.15,37.19 44.15,36.58 U$6.3
N$10
  Bottom 0.254: R13.1 56.13,34.54 49.63,34.54 47.9,32.82 37.13,32.82 C7.1
N$17
  Top 0.254: R5.2 32.46,48.26 30.84,49.89 29.62,49.89 U2.5 29.62,49.99 29.62,50.7 29.31,51 27.38,51 25.65,49.28 25.65,36.47 19.15,29.97 18.44,29.97 17.12,28.65 17.12,8.23 18.24,7.11 18.95,7.11 23.62,2.44 65.38,2.44 67.82,4.88 68.94,4.88 U$1.19-A5/SCL0
N$22
  Top 0.254: U2.4 29.11,49.89 29.11,49.07 30.94,47.24 34.49,47.24 35.51,48.26 R2.2
  Bottom 0.254: U$1.18-A4/SDA0 66.4,4.88 65.28,4.88 62.03,1.63 30.12,1.63 17.12,14.63 17.12,56.59 18.24,57.71 26.06,57.71 35.51,48.26 R2.2
N$24
  Top 0.254: IC3.9 42.01,54.15 42.01,53.54 41.81,53.34 41.5,53.34 38.56,50.39 38.56,49.58 C19.1
N$30
  Bottom 0.254: LED3.K 20.37,66.75 36.02,66.75 54.2,48.56 55.42,48.56 R15.1
N$39
  Top 0.254: LED1.K 62.54,48.56 61.42,48.56 R9.1
N$46
  Top 0.254: 42.72,37.8 42.72,36.58 U$6.2 | 42.72,37.8 41.2,39.32 37.13,39.32 C8.1 | R21.1 49.53,38.3 43.33,38.3 42.82,37.8 42.72,37.8
O1_RX
  Top 0.254: U$1.0-RX1/CS1/CRX2 84.18,20.22 83.16,20.22 82.14,21.23 81.23,21.23 80.21,20.22 80.21,19.81 78.69,18.29 74.93,18.29 73.81,17.17 73.81,16.76 63.04,5.99 60.91,5.99 59.89,4.98 59.89,4.57 59.18,3.86 23.11,3.86 18.74,8.23 P2.2
O1_TX
  Top 0.254: U$1.1-TX1/MISO1/CTX2 81.64,20.12 81.64,14.02 72.59,4.98 72.59,4.57 70.05,2.03 22.4,2.03 18.74,5.69 P2.3
O2_RX
  Bottom 0.254: U$1.7-RX2/OUT1A 66.4,20.12 66.4,18.69 57.76,10.06 57.76,4.37 55.42,2.03 32.26,2.03 29.41,4.88 29.41,7.72 18.74,18.39 P5.2
O2_TX  (via drill 0.35)
  Top 0.254: v26.67,15.85 18.74,15.85 P5.3
  Bottom 0.254: v26.67,15.85 37.03,5.49 37.03,4.88 39.47,2.44 55.22,2.44 57.35,4.57 57.35,10.26 63.86,16.76 63.86,20.12 U$1.8-TX2/IN1
O3_RX  (via drill 0.35)
  Top 0.254: v47.19,16.56 U$1.15-A1/RX3/SPDIF_IN | v21.79,25.2 21.79,25.5 18.74,28.55 P6.2
  Bottom 0.254: v47.19,16.56 30.43,16.56 v21.79,25.2
O3_TX  (via drill 0.35)
  Top 0.254: v21.79,23.77 20.98,23.77 18.74,26.01 P6.3
  Bottom 0.254: v21.79,23.77 34.09,11.48 48.72,11.48 55.22,4.98 56.24,4.98 U$1.14-A0/TX3/SPDIF_OUT
O4_RX
  Bottom 0.254: U$1.34-RX8 30.84,4.98 30.84,10.67 20.27,21.23 20.27,33.02 17.53,35.76 17.53,37.59 18.64,38.71 P7.2
O4_TX  (via drill 0.35)
  Top 0.254: v33.38,10.57 33.38,4.98 U$1.35-TX8
  Bottom 0.254: v33.38,10.57 20.68,23.27 20.68,34.24 18.74,36.17 P7.3
O5_RX
  Top 0.254: U$1.21-A7/RX5/BCLK1 74.02,4.88 73.51,4.88 70.16,1.52 21.29,1.52 16.71,6.1 16.71,46.94 18.64,48.87 P8.2
O5_TX  (via drill 0.35)
  Top 0.254: v41.3,3.15 63.55,3.15 64.97,4.57 64.97,4.98 65.99,5.99 69.44,5.99 70.46,4.98 71.48,4.98 U$1.20-A6/TX5/LRCLK1
  Bottom 0.254: v41.3,3.15 39.57,4.88 39.57,5.38 21.89,23.06 21.49,23.06 21.08,23.47 21.08,38 18.95,40.13 18.14,40.13 17.53,40.74 17.53,45.21 18.64,46.33 P8.3
O6_RX  (via drill 0.35)
  Top 0.254: v20.37,40.54 20.37,61.47 19.05,62.79 18.24,62.79 17.53,62.08 17.53,60.25 18.64,59.13 P9.2
  Bottom 0.254: v20.37,40.54 28.91,32 31.85,32 38.76,25.09 39.37,25.09 40.49,23.98 40.49,23.57 41.5,22.55 42.72,22.55 45.06,20.22 46.08,20.22 U$1.25-A11/RX6/SDA2
O6_TX
  Bottom 0.254: U$1.24-A10/TX6/SCL2 48.62,20.22 48.62,20.52 45.57,23.57 45.57,23.98 44.45,25.09 44.04,25.09 43.03,26.11 43.03,26.52 37.74,31.8 36.63,31.8 34.8,33.63 34.8,41.96 25.76,51 25.76,53.03 22.3,56.49 18.74,56.49 P9.3
PMS+  (via drill 0.35)
  Top 0.254: 28.09,55.27 28.09,69.9 24.33,73.66 SJ5.1 | 28.09,55.27 28.09,54.25 U2.9 | 56.13,34.04 49.63,34.04 47.19,36.47 45.36,36.47 U$6.4 45.36,36.37 45.36,35.97 44.45,35.05 42.42,35.05 42.22,35.26 42.22,37.69 42.01,37.9 41.1,37.9 39.78,36.58 33.38,36.58 32.77,37.19 32.77,38 33.58,38.81 33.58,39.32 C26.1 | R20.1 56.13,34.04 | R21.2 57.15,36.98 56.13,35.97 56.13,34.04 | 28.09,55.27 27.28,55.27 25.04,53.03 v25.04,52.73
  Bottom 0.254: 28.3,43.08 30.12,43.08 33.58,39.62 33.58,39.42 C26.1 | 28.3,43.08 27.18,41.96 C14.+ | v25.04,52.73 25.04,46.43 28.3,43.18 28.3,43.08
POWER+
  Top 1.575: CON2.+ 11.43,8.33 11.43,13.31 C16.1 11.43,17.68 CON1.+ 11.43,18.49 11.43,23.47 C9.1 11.43,27.84 CON3.+ 11.43,28.65 11.43,33.63 C10.1 11.43,38 CON4.+ 11.43,38.81 11.43,43.79 C11.1 11.43,48.16 CON5.+ 11.43,48.97 11.43,53.95 C12.1 11.43,58.32 CON6.+ 11.43,59.13 C13.1 11.43,64.52 17.83,70.92 22.71,70.92 SJ3.2
  Bottom 1.575: U$5.1 59.28,85.04 59.28,85.85 57.56,87.58 49.73,87.58 48.31,86.16 U$2.1 47.6,85.04 47.6,85.85 45.87,87.58 41.81,87.58 39.27,85.04 36.22,85.04 U$3.1 35.92,84.23 35.92,83.82 28.5,76.4 23.32,76.4 11.43,64.52 C13.1
R_CLK
  Bottom 0.254: K1.23 59.69,26.21 60.81,26.21 63.96,29.36 68.43,29.36 73,33.93 83.87,33.93 84.99,32.82 P3.5
R_CS/GPIO27
  Top 0.254: K1.11 74.93,26.21 76.05,26.21 81.43,31.6 86.41,31.6 87.53,32.72 P3.6
R_DC/GPIO22
  Top 0.254: K1.13 72.39,27.64 77.47,32.72 P3.2
R_MOSI
  Top 0.254: K1.19 64.77,28.45 67.72,31.39 67.72,38.91 69.85,41.05 71.58,41.05 73.81,38.81 73.81,32.31 74.52,31.6 75.44,31.6 76.35,32.51 76.35,33.22 77.06,33.93 78.89,33.93 80.01,32.82 P3.3
R_RST/GPIO5
  Bottom 0.254: K1.29 52.07,26.21 53.19,26.21 56.44,29.46 63.45,29.46 63.75,29.77 68.22,29.77 72.8,34.34 85.09,34.34 86.21,33.22 86.21,32.31 85.5,31.6 83.67,31.6 82.55,32.72 P3.4
RASP_INT
  Top 0.254: U$1.2-OUT2 79.1,20.22 79.1,23.06 78.89,23.27 78.89,24.99 80.01,26.11 K1.7
RXD  (via drill 0.35)
  Top 0.254: v62.03,30.18 41.3,30.18 37.85,26.72 37.85,24.69 36.02,22.86 36.02,20.22 U$1.29-TX7
  Bottom 0.254: v62.03,30.18 69.55,37.69 86.11,37.69 87.22,38.81 P14.4
SENS1
  Top 0.254: U$1.22-A8/CTX1 76.66,4.98 76.66,8.13 88.95,20.42 88.95,36.47 90.88,38.41 90.88,50.34 89.97,51.26 P1.3
SENS2
  Top 0.254: U$1.23-A9/CRX1/MCLK1 79.2,4.98 79.2,10.06 90.17,21.03 90.17,31.19 91.29,32.31 91.29,55.63 89.97,56.95 P11.3
SENS3
  Top 0.254: U$1.38-A14/CS/IN1 41,4.98 41,5.99 37.44,9.55 37.44,23.67 38.25,24.49 38.25,26.52 41.2,29.46 63.45,29.46 63.75,29.77 64.87,29.77 66.9,31.8 66.9,39.32 73.61,46.02 78.89,46.02 78.99,46.13 82.35,46.13 83.57,44.91 83.57,44.09 84.28,43.38 85.19,43.38 86.11,44.3 86.11,48.41 88.75,51.05 88.75,61.62 89.86,62.74 P12.3
SENS4  (via drill 0.35)
  Top 0.254: v48.31,21.84 47.6,21.13 47.6,20.22 41.4,14.02 40.49,14.02 39.98,13.51 39.98,9.55 40.59,8.94 41.1,8.94 43.54,6.5 43.54,4.98 U$1.39-A15/CS/OUT1A
  Bottom 0.254: v48.31,21.84 48.31,26.42 53.9,32 57.56,32 58.88,33.33 58.88,40.03 62.84,43.99 62.84,53.03 71.02,61.21 87.43,61.21 88.75,62.53 88.75,67.31 89.86,68.43 P13.3
SHDN  (via drill 0.35)
  Top 0.254: U$8.5 65.28,73.15 71.48,66.95 71.48,63.2 69.04,60.76 69.04,58.32 69.95,57.4 70.76,57.4 71.37,56.79 71.37,55.68 64.26,48.56 R6.1 | v68.43,38.61 68.43,23.57 68.94,23.06 68.94,20.22 U$1.6-OUT1D
  Bottom 0.254: v68.43,38.61 63.25,43.79 63.25,47.45 64.26,48.46 R6.1
SW
  Top 0.406: U$6.6 44.15,41.76 45.26,41.76 U$6.5 45.47,41.66 47.3,41.66 49.63,39.32 57.56,39.32 60.2,36.68 D2.C 62.23,30.99 64.36,30.99 L2.1
SWTCH
  Top 0.254: R20.2 43.84,33.02 41.61,35.26 41.61,36.47 U$6.1
  Bottom 0.254: R20.2 50.55,34.04 57.05,34.04 58.17,35.15 58.17,42.98 59.28,44.09 59.28,64.11 72.95,77.78 86.05,77.78 P15.1
TGUP
  Top 0.254: IC3.7 43.03,54.15 43.03,53.65 43.33,53.34 43.64,53.34 45.77,51.21 45.77,49.07 46.28,48.56 49.84,48.56 R10.1
TS
  Top 0.254: IC3.8 42.52,54.25 42.52,54.76 42.32,54.97 38.86,54.97 38.56,54.66 C19.2 | SJ3.1 24.23,70.92 24.23,70.61 19.96,66.34 18.34,66.34 LED3.A
  Bottom 0.254: C19.2 38.46,54.66 38.15,54.66 26.57,66.24 18.34,66.24 LED3.A
TXD
  Top 0.254: U$1.28-RX7 38.56,20.22 39.57,20.22 41.91,22.55 57.56,22.55 58.57,23.57 58.57,23.98 59.69,25.09 60.1,25.09 61.11,26.11 61.11,26.52 63.96,29.36 65.08,29.36 67.31,31.6 67.31,39.12 73.81,45.62 79.1,45.62 79.2,45.72 80.21,45.72 81.03,44.91 81.03,43.89 84.68,40.23 84.68,38.91 P14.3
V+  (via drill 0.35)
  Top 0.254: 27.58,53.44 27.58,54.15 U2.10 | 27.58,53.44 27.89,53.14 28.3,53.14 28.5,53.34 28.5,54.15 U2.8 | v24.33,75.08 24.33,79.35 SJ1.2 | v24.33,67.46 24.33,52.43 24.74,52.02 26.06,52.02 27.48,53.44 27.58,53.44
  Bottom 0.254: v24.33,67.46 v24.33,75.08

### Text on the board
tNames: 1.2 | Cerebellar / Jochen Alt